# Altium schematic sheet THS7002CPWP_Schematic_2.SchDoc
size A; SheetNumber: 4; SheetTotal: 4
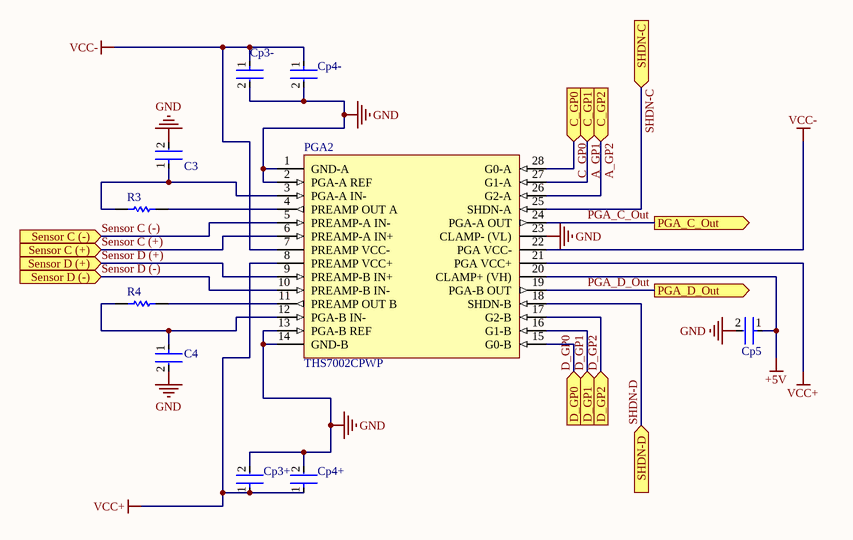
[diagram p0: THS7002CPWP_Schematic_2.SchDoc]

## Parts
C3  GRM3195C1H163JA01D  [FP-GRM319-0_15-IPC_A]  (value not drawn)
C4  GRM3195C1H163JA01D  [FP-GRM319-0_15-IPC_A]  (value not drawn)
Cp3+  CC0603KRX7R7BB104  [FP-CC0603-DA-MFG]  (value not drawn)
Cp3-  CC0603KRX7R7BB104  [FP-CC0603-DA-MFG]  (value not drawn)
Cp4+  C2012JB1A685K060AC  [FP-C2012-060-0_2-IPC_A]  (value not drawn)
Cp4-  C2012JB1A685K060AC  [FP-C2012-060-0_2-IPC_A]  (value not drawn)
Cp5  C2012JB1A685K060AC  [FP-C2012-060-0_2-IPC_A]  (value not drawn)
PGA2  THS7002CPWP  [PWP0028E_M]
R3  CRCW08050000Z0EA  [RESC2013X50X30LL20T20]  (value not drawn)
R4  CRCW08050000Z0EA  [RESC2013X50X30LL20T20]  (value not drawn)

## Ports
C_GP0 (in, see Capstone_Signal_Conditioners_Subsystem_Test_Schematic[2A]), C_GP1 (in, see Capstone_Signal_Conditioners_Subsystem_Test_Schematic[2A]), C_GP2 (in, see Capstone_Signal_Conditioners_Subsystem_Test_Schematic[3A]), D_GP0 (in, see Capstone_Signal_Conditioners_Subsystem_Test_Schematic[2B]), D_GP1 (in, see Capstone_Signal_Conditioners_Subsystem_Test_Schematic[2B]), D_GP2 (in, see Capstone_Signal_Conditioners_Subsystem_Test_Schematic[3B]), PGA_C_Out (out, see Capstone_Signal_Conditioners_Subsystem_Test_Schematic[3B], LTC6362_Schematic[1B]), PGA_D_Out (out, see Capstone_Signal_Conditioners_Subsystem_Test_Schematic[3B], LTC6362_Schematic[1B]), Sensor C (+) (in, see Capstone_Signal_Conditioners_Subsystem_Test_Schematic[2B]), Sensor C (-) (in, see Capstone_Signal_Conditioners_Subsystem_Test_Schematic[2B]), Sensor D (+) (in, see Capstone_Signal_Conditioners_Subsystem_Test_Schematic[2B]), Sensor D (-) (in, see Capstone_Signal_Conditioners_Subsystem_Test_Schematic[2B]), SHDN-C (in, see Capstone_Signal_Conditioners_Subsystem_Test_Schematic[3A]), SHDN-D (in, see Capstone_Signal_Conditioners_Subsystem_Test_Schematic[3B], LTC6362_Schematic[2C])

## Nets
+5V: Cp5.1 PGA2.20(CLAMP+_(VH))
GND: C3.2 C4.2 Cp3+.2 Cp3-.2 Cp4+.2 Cp4-.2 Cp5.2 PGA2.1(GND-A) PGA2.2(PGA-A_REF) PGA2.13(PGA-B_REF) PGA2.14(GND-B) PGA2.23(CLAMP-_(VL))
VCC+: Cp3+.1 Cp4+.1 PGA2.8(PREAMP_VCC+) PGA2.21(PGA_VCC+)
VCC-: Cp3-.1 Cp4-.1 PGA2.7(PREAMP_VCC-) PGA2.22(PGA_VCC-)
A_GP1: PGA2.27(G1-A) ; port C_GP1
A_GP2: PGA2.26(G2-A) ; port C_GP2
C_GP0: PGA2.28(G0-A) ; port C_GP0
D_GP0: PGA2.15(G0-B) ; port D_GP0
D_GP1: PGA2.16(G1-B) ; port D_GP1
D_GP2: PGA2.17(G2-B) ; port D_GP2
PGA_C_Out: PGA2.24(PGA-A_OUT) ; port PGA_C_Out
PGA_D_Out: PGA2.19(PGA-B_OUT) ; port PGA_D_Out
Sensor C (+): PGA2.6(PREAMP-A_IN+) ; port Sensor C (+)
Sensor C (-): PGA2.5(PREAMP-A_IN-) ; port Sensor C (-)
Sensor D (+): PGA2.9(PREAMP-B_IN+) ; port Sensor D (+)
Sensor D (-): PGA2.10(PREAMP-B_IN-) ; port Sensor D (-)
SHDN-C: PGA2.25(SHDN-A) ; port SHDN-C
SHDN-D: PGA2.18(SHDN-B) ; port SHDN-D
NetC3_1: C3.1 PGA2.3(PGA-A_IN-) R3.1
NetC4_1: C4.1 PGA2.12(PGA-B_IN-) R4.1
NetPGA2_4: PGA2.4(PREAMP_OUT_A) R3.2
NetPGA2_11: PGA2.11(PREAMP_OUT_B) R4.2

## Library data of the parts
C3 C4 = CMP-06035-007665-1: Chip Multilayer Ceramic Capacitors for General Purpose, 1206, 16000pF, C0G, 30ppm/°C, 5%, 50V; Capacitance: 16nF; Tolerance: 5%; Case Code (Metric): 3216; Length: 3.2mm; Package Quantity: 4000; Mount: Surface Mount; Voltage Rating (DC): 50V; Voltage Rating: 50V; Case Code (Imperial): 1206; Height: 0.85mm; Min Operating Temperature: -55°C; Max Operating Temperature: 125°C; Termination: SMD/SMT; Width: 0.063inch; Radiation Hardening: No; Depth: 1.6mm; Thickness: 0.037inch; Dielectric: C0G; Case/Package: 1206; Packaging: Tape and Reel
Cp3+ Cp3- = CMP-2000-05002-2: CAP CER 0.1UF 16V X7R 0603; Manufacturer: YAGEO; Tolerance: 0.1; Value: 100 nF; Temperature Coefficient: 15%; Description: CC0603 100 nF X7R 10.00% 16 V; Voltage Rating: 16 V; Package: CC0603-DA; ComponentLink2Description: Datasheet; Octopart: https://octopart.com/cc0603krx7r7bb104-yageo-192941; Temperature Range High: +125°C; Digikey Description: CAP CER 0.1UF 16V X7R 0603; Voltage: 16 V; Device Class L2: Capacitors; Height: 0.9mm; Temperature: -55°C to +125°C; Manufacturer Part Number: CC0603KRX7R7BB104; Device Class L1: Passive Components; Device Class L3: Ceramic Capacitors; ComponentLink2URL: http://www.yageo.com/documents/recent/UPY-GPHC_X7R_6.3V-to-50V_18.pdf; Footprint Url: http://www.yageo.com/exep/pages/download/literatures/UPY-C_GEN_24.pdf; RoHS: TRUE; Temperature Range Low: -55°C; Temperature Characteristic: X7R; Lead Free: Yes; Capacitance: 100 nF; Category: Cap; Mouser Description: Multilayer Ceramic Capacitor, CC Series, 0.1 - F, - 10%, X7R, 16 V, 0603 [1608 Metric]; Material: Ceramic; Automotive: No
Cp4+ Cp4- Cp5 = CMP-08246-004641-1: Multilayer Ceramic Capacitors 6.8μF ±10% 10V JB SMD 0805; Capacitance: 6.8uF; RoHS Compliant: Yes; Case Code (Metric): 5032; Case/Package: 0805; Voltage Rating: 10V; Width: 0.049inch; Min Operating Temperature: -25°C; Mount: Surface Mount; Voltage Rating (DC): 10V; Dielectric Material: Ceramic; Case Code (Imperial): 2012; Package Quantity: 4000; Lead Free: Lead Free; Packaging: Tape and Reel; Length: 0.079inch; Tolerance: 10%; Thickness: 0.028inch; Max Operating Temperature: 85°C; Series: C
PGA2 = CMP-0988-00132-2: 70-MHz High-Speed Programmable-Gain Amplifier, Dual, 0 to 70 degC, 28-pin SOP (PWP28), Green (RoHS & no Sb/Br); Manufacturer: Texas Instruments; Disable: TRUE; BW @ Acl(MHz): 100; Vs(Min)(V): 9; Vs(Max)(V): 32; Number of Channels: 2; Vio(Max)(mV): 7; Iib(Max)(nA): 6000; SubFamily: Variable Gain Amplifier; Vn at Flatband(Typ)(nV/rtHz): 1.7; Slew Rate(Typ)(V/us): 85; ComponentLink1Description: Manufacturer URL; Code_JEDEC: MO-153; PackageVersion: 4073225-6/I, 05/2011; PackageReference: PWP0028E; Eco-Plan: Green (RoHS & no Sb/Br); ComponentLink2URL: http://www.ti.com/general/docs/lit/getliterature.tsp?genericPartNumber=THS7002&fileType=pdf; PackageDescription: 28-Pin Plastic Small Outline, Body 4.4 x 9.7 mm, Pitch 0.65 mm; DatasheetVersion: SLOS214C; ComponentLink3URL: http://www.ti.com/litv/pdf/mpds373; ComponentLink3Description: Package Specification; ComponentLink1URL: http://www.ti.com/; ComponentLink2Description: Datasheet; Mounting Technology: Surface Mount; PartNumber: THS7002CPWP
R3 R4 = CMP-2001-04896-1: Manufacturer: Vishay Dale; Part Number: CRCW08050000Z0EA